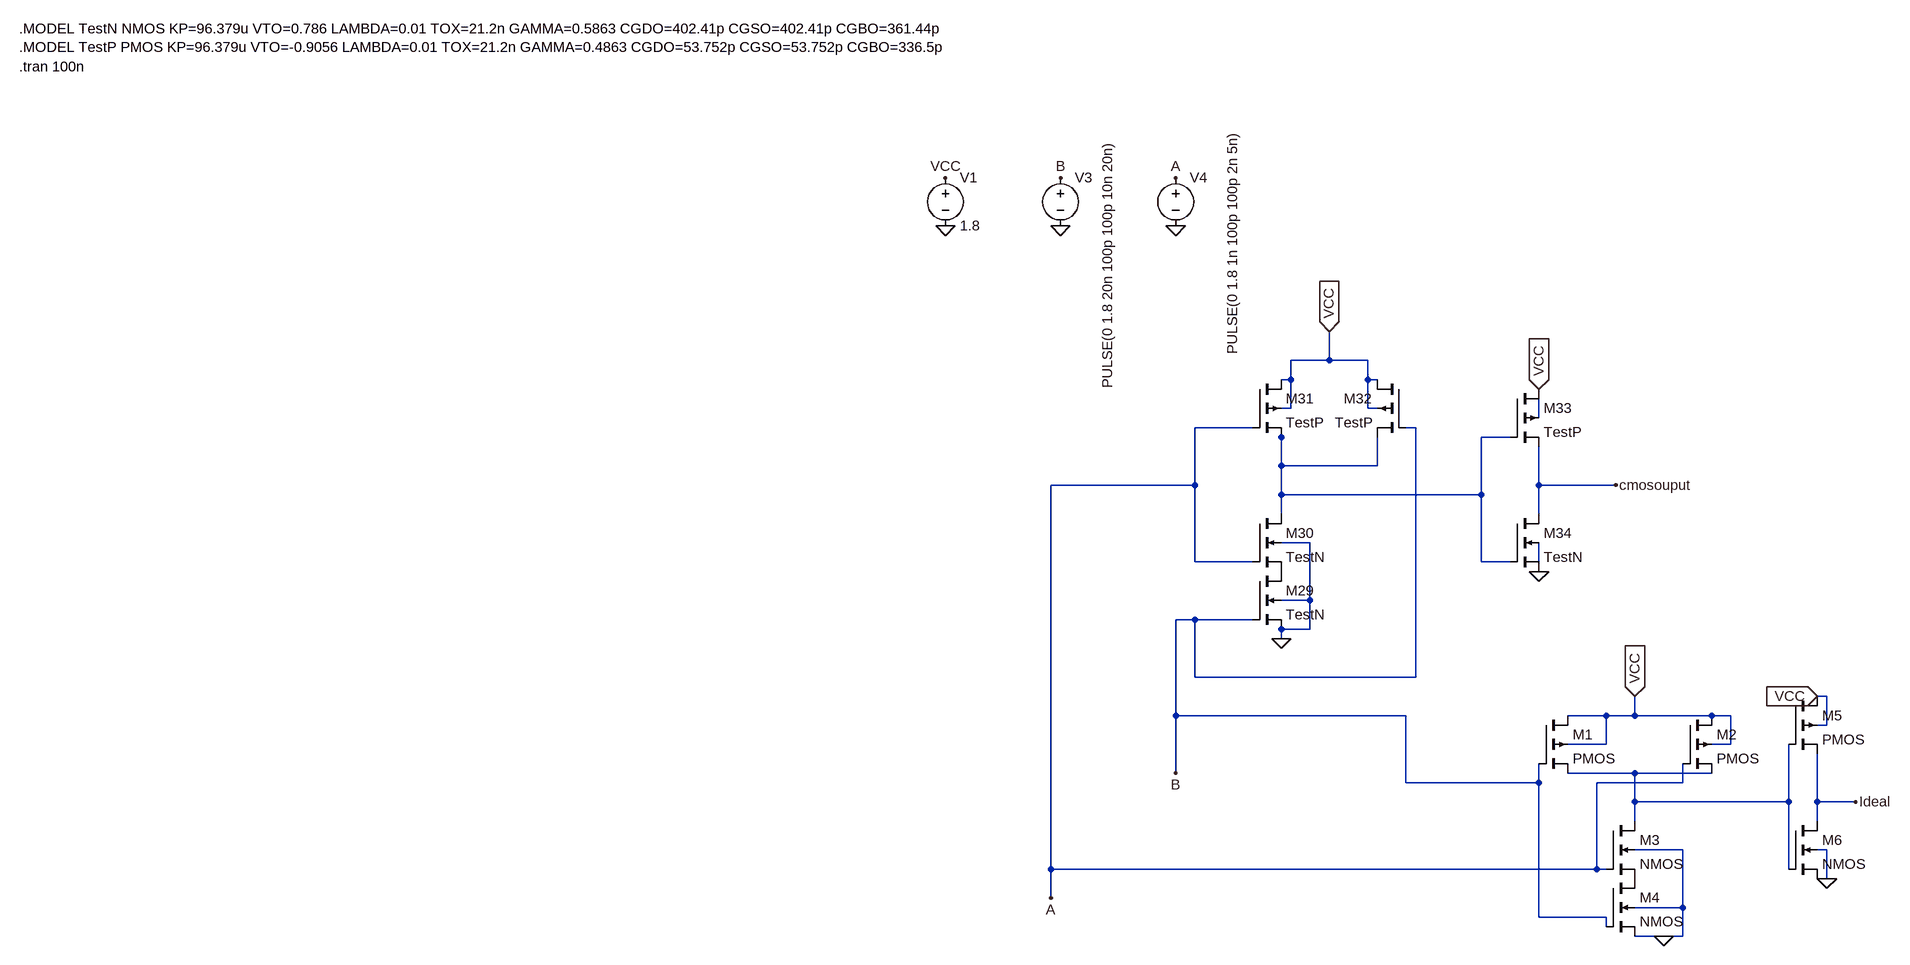
[diagram p0: schematic ANDgates.asc]
ANDgates.asc, the LTspice schematic file:
Version 4
SHEET 1 2780 2656
WIRE 1808 512 1808 464
WIRE 1808 512 1744 512
WIRE 1872 512 1808 512
WIRE 1744 544 1744 512
WIRE 1744 544 1728 544
WIRE 1872 544 1872 512
WIRE 1888 544 1872 544
WIRE 1744 592 1744 544
WIRE 1744 592 1728 592
WIRE 1872 592 1872 544
WIRE 1888 592 1872 592
WIRE 2176 608 2176 576
WIRE 1680 624 1584 624
WIRE 1952 624 1936 624
WIRE 1728 640 1728 624
WIRE 2128 640 2080 640
WIRE 1728 688 1728 640
WIRE 1888 688 1888 640
WIRE 1888 688 1728 688
WIRE 1584 720 1584 624
WIRE 1584 720 1344 720
WIRE 2176 720 2176 656
WIRE 2304 720 2176 720
WIRE 1728 736 1728 688
WIRE 2080 736 2080 640
WIRE 2080 736 1728 736
WIRE 1728 768 1728 736
WIRE 2176 768 2176 720
WIRE 1776 816 1728 816
WIRE 1584 848 1584 720
WIRE 1680 848 1584 848
WIRE 2080 848 2080 736
WIRE 2128 848 2080 848
WIRE 2176 848 2176 816
WIRE 1776 912 1776 816
WIRE 1776 912 1728 912
WIRE 1584 944 1552 944
WIRE 1680 944 1584 944
WIRE 1776 960 1776 912
WIRE 1776 960 1728 960
WIRE 1728 976 1728 960
WIRE 1584 1040 1584 944
WIRE 1952 1040 1952 624
WIRE 1952 1040 1584 1040
WIRE 2656 1072 2640 1072
WIRE 1552 1104 1552 944
WIRE 1936 1104 1552 1104
WIRE 2288 1104 2224 1104
WIRE 2336 1104 2336 1072
WIRE 2336 1104 2288 1104
WIRE 2464 1104 2336 1104
WIRE 2496 1104 2464 1104
WIRE 2656 1120 2656 1072
WIRE 2656 1120 2640 1120
WIRE 2288 1152 2288 1104
WIRE 2288 1152 2224 1152
WIRE 2496 1152 2496 1104
WIRE 2496 1152 2464 1152
WIRE 1552 1200 1552 1104
WIRE 2336 1200 2224 1200
WIRE 2464 1200 2336 1200
WIRE 1936 1216 1936 1104
WIRE 2176 1216 2176 1184
WIRE 2176 1216 1936 1216
WIRE 2416 1216 2416 1184
WIRE 2416 1216 2272 1216
WIRE 2336 1248 2336 1200
WIRE 2592 1248 2592 1152
WIRE 2592 1248 2336 1248
WIRE 2640 1248 2640 1168
WIRE 2704 1248 2640 1248
WIRE 2336 1280 2336 1248
WIRE 2640 1280 2640 1248
WIRE 2416 1328 2336 1328
WIRE 2656 1328 2640 1328
WIRE 1344 1360 1344 720
WIRE 2272 1360 2272 1216
WIRE 2272 1360 1344 1360
WIRE 2288 1360 2272 1360
WIRE 2592 1360 2592 1248
WIRE 2656 1376 2656 1328
WIRE 2656 1376 2640 1376
WIRE 1344 1408 1344 1360
WIRE 2416 1424 2416 1328
WIRE 2416 1424 2336 1424
WIRE 2176 1440 2176 1216
WIRE 2288 1440 2176 1440
WIRE 2288 1456 2288 1440
WIRE 2384 1472 2336 1472
WIRE 2416 1472 2416 1424
WIRE 2416 1472 2384 1472
FLAG 2176 560 VCC
IOPIN 2176 560 In
FLAG 2176 864 0
FLAG 1808 464 VCC
IOPIN 1808 464 In
FLAG 1728 976 0
FLAG 2304 720 cmosouput
FLAG 928 288 0
FLAG 1360 288 0
FLAG 1552 288 0
FLAG 928 208 VCC
FLAG 1552 208 A
FLAG 1360 208 B
FLAG 1344 1408 A
FLAG 1552 1200 B
FLAG 2336 1072 VCC
IOPIN 2336 1072 In
FLAG 2384 1472 0
FLAG 2704 1248 Ideal
FLAG 2640 1072 VCC
IOPIN 2640 1072 In
FLAG 2656 1376 0
SYMBOL nmos4 1680 864 R0
SYMATTR InstName M29
SYMATTR Value TestN
SYMATTR Value2 l=10u w=20u
SYMBOL nmos4 1680 768 R0
SYMATTR InstName M30
SYMATTR Value TestN
SYMATTR Value2 l=10u w=20u
SYMBOL pmos4 1680 544 R0
SYMATTR InstName M31
SYMATTR Value TestP
SYMATTR Value2 l=10u w=40u
SYMBOL pmos4 1936 544 M0
SYMATTR InstName M32
SYMATTR Value TestP
SYMATTR Value2 l=10u w=40u
SYMBOL pmos4 2128 560 R0
SYMATTR InstName M33
SYMATTR Value TestP
SYMATTR Value2 l=10u w=40u
SYMBOL nmos4 2128 768 R0
SYMATTR InstName M34
SYMATTR Value TestN
SYMATTR Value2 l=10u w=20u
SYMBOL voltage 928 192 R0
WINDOW 123 0 0 Left 0
WINDOW 39 0 0 Left 0
SYMATTR InstName V1
SYMATTR Value 1.8
SYMBOL voltage 1360 192 R0
WINDOW 3 79 -45 VRight 2
WINDOW 123 0 0 Left 0
WINDOW 39 0 0 Left 0
SYMATTR Value PULSE(0 1.8 20n 100p 100p 10n 20n)
SYMATTR InstName V3
SYMBOL voltage 1552 192 R0
WINDOW 3 95 -61 VRight 2
WINDOW 123 0 0 Left 0
WINDOW 39 0 0 Left 0
SYMATTR Value PULSE(0 1.8 1n 100p 100p 2n 5n)
SYMATTR InstName V4
SYMBOL pmos4 2176 1104 R0
SYMATTR InstName M1
SYMBOL pmos4 2416 1104 R0
SYMATTR InstName M2
SYMBOL nmos4 2288 1280 R0
SYMATTR InstName M3
SYMBOL nmos4 2288 1376 R0
SYMATTR InstName M4
SYMBOL pmos4 2592 1072 R0
SYMATTR InstName M5
SYMBOL nmos4 2592 1280 R0
SYMATTR InstName M6
TEXT -616 -136 Left 2 !.MODEL TestN NMOS KP=96.379u VTO=0.786 LAMBDA=0.01 TOX=21.2n GAMMA=0.5863 CGDO=402.41p CGSO=402.41p CGBO=361.44p\n.MODEL TestP PMOS KP=96.379u VTO=-0.9056 LAMBDA=0.01 TOX=21.2n GAMMA=0.4863 CGDO=53.752p CGSO=53.752p CGBO=336.5p
TEXT -616 -72 Left 2 !.tran 100n

The netlist it stands for:
* ANDgates.asc
M29 P001 B 0 0 TestN l=10u w=20u
M30 N002 A P001 0 TestN l=10u w=20u
M31 VCC A N002 VCC TestP l=10u w=40u
M32 VCC B N002 VCC TestP l=10u w=40u
M33 VCC N002 cmosouput N001 TestP l=10u w=40u
M34 cmosouput N002 0 N003 TestN l=10u w=20u
V1 VCC 0 1.8
V3 B 0 PULSE(0 1.8 20n 100p 100p 10n 20n)
V4 A 0 PULSE(0 1.8 1n 100p 100p 2n 5n)
M1 VCC B N004 VCC PMOS
M2 VCC A N004 VCC PMOS
M3 N004 A P002 0 NMOS
M4 P002 B 0 0 NMOS
M5 VCC N004 Ideal VCC PMOS
M6 Ideal N004 0 0 NMOS
.model NMOS NMOS
.model PMOS PMOS
.lib standard.mos
.MODEL TestN NMOS KP=96.379u VTO=0.786 LAMBDA=0.01 TOX=21.2n GAMMA=0.5863 CGDO=402.41p CGSO=402.41p CGBO=361.44p
.MODEL TestP PMOS KP=96.379u VTO=-0.9056 LAMBDA=0.01 TOX=21.2n GAMMA=0.4863 CGDO=53.752p CGSO=53.752p CGBO=336.5p
.tran 100n
.backanno
.end